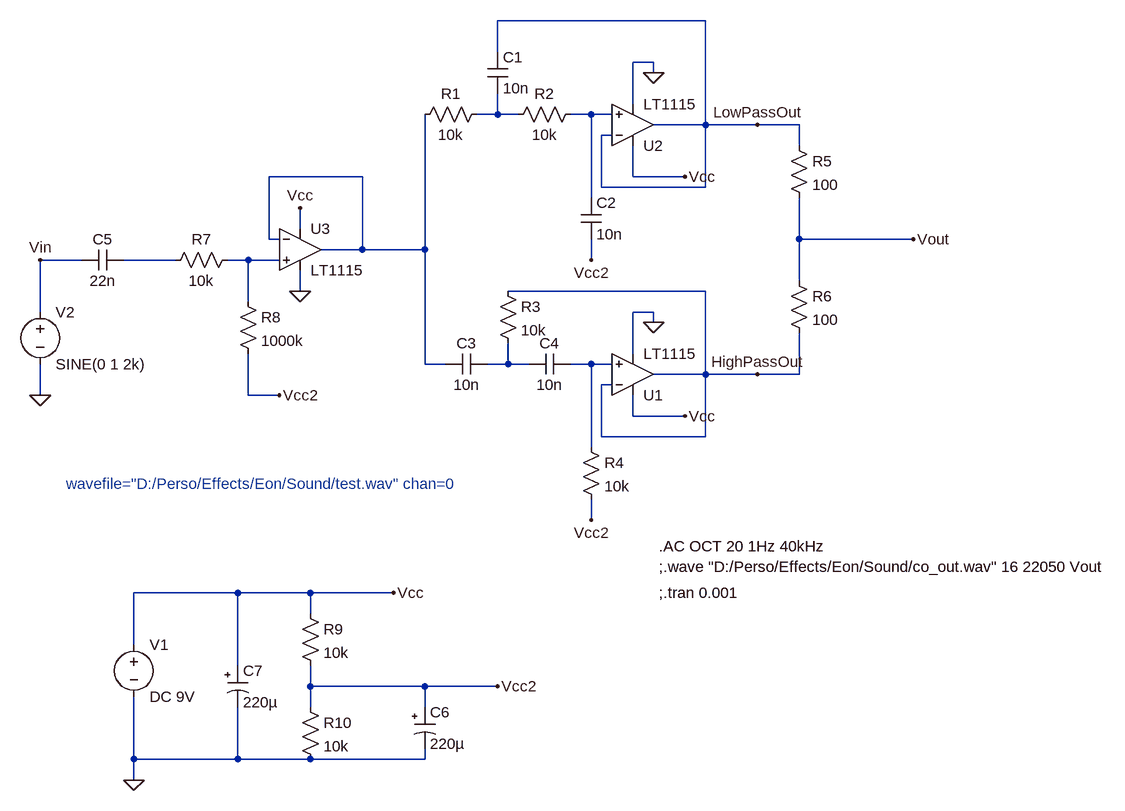
[diagram p0: schematic crossover_add.asc]
crossover_add.asc, the LTspice schematic file:
Version 4
SHEET 1 1140 1104
WIRE -32 -80 -352 -80
WIRE -352 -32 -352 -80
WIRE -112 -16 -144 -16
WIRE -112 0 -112 -16
WIRE -144 48 -144 -16
WIRE -352 64 -352 32
WIRE -352 64 -384 64
WIRE -320 64 -352 64
WIRE -208 64 -240 64
WIRE -176 64 -208 64
WIRE -32 80 -32 -80
WIRE -32 80 -112 80
WIRE 48 80 -32 80
WIRE 112 80 48 80
WIRE -176 96 -192 96
WIRE 112 112 112 80
WIRE -560 160 -704 160
WIRE -144 160 -144 112
WIRE -64 160 -144 160
WIRE -192 176 -192 96
WIRE -32 176 -32 80
WIRE -32 176 -192 176
WIRE -208 192 -208 64
WIRE -656 240 -656 208
WIRE -704 256 -704 160
WIRE -688 256 -704 256
WIRE 112 256 112 192
WIRE 288 256 112 256
WIRE -560 272 -560 160
WIRE -560 272 -624 272
WIRE -464 272 -464 64
WIRE -464 272 -560 272
WIRE -992 288 -1056 288
WIRE -848 288 -928 288
WIRE -736 288 -768 288
WIRE -688 288 -736 288
WIRE -208 288 -208 256
WIRE 112 320 112 256
WIRE -656 336 -656 304
WIRE -32 336 -336 336
WIRE -736 352 -736 288
WIRE -1056 368 -1056 288
WIRE -112 368 -144 368
WIRE -112 384 -112 368
WIRE -144 432 -144 368
WIRE -464 448 -464 272
WIRE -432 448 -464 448
WIRE -336 448 -336 416
WIRE -336 448 -368 448
WIRE -304 448 -336 448
WIRE -208 448 -240 448
WIRE -176 448 -208 448
WIRE -32 464 -32 336
WIRE -32 464 -112 464
WIRE 48 464 -32 464
WIRE 112 464 112 400
WIRE 112 464 48 464
WIRE -176 480 -192 480
WIRE -1056 496 -1056 448
WIRE -736 496 -736 432
WIRE -688 496 -736 496
WIRE -144 528 -144 496
WIRE -64 528 -144 528
WIRE -192 560 -192 480
WIRE -32 560 -32 464
WIRE -32 560 -192 560
WIRE -208 576 -208 448
WIRE -208 688 -208 656
WIRE -752 800 -912 800
WIRE -640 800 -752 800
WIRE -512 800 -640 800
WIRE -640 832 -640 800
WIRE -912 880 -912 800
WIRE -752 912 -752 800
WIRE -640 944 -640 912
WIRE -464 944 -640 944
WIRE -352 944 -464 944
WIRE -640 976 -640 944
WIRE -464 976 -464 944
WIRE -912 1056 -912 960
WIRE -752 1056 -752 976
WIRE -752 1056 -912 1056
WIRE -640 1056 -752 1056
WIRE -464 1056 -464 1040
WIRE -464 1056 -640 1056
WIRE -912 1088 -912 1056
FLAG -208 288 Vcc2
FLAG -208 688 Vcc2
FLAG -112 0 0
FLAG -112 384 0
FLAG -64 528 Vcc
FLAG -64 160 Vcc
FLAG -688 496 Vcc2
FLAG -1056 288 Vin
FLAG -656 208 Vcc
FLAG -656 336 0
FLAG -912 1088 0
FLAG -512 800 Vcc
FLAG -352 944 Vcc2
FLAG -1056 496 0
FLAG 48 80 LowPassOut
FLAG 48 464 HighPassOut
FLAG 288 256 Vout
SYMBOL LT1115 -144 528 M180
SYMATTR InstName U1
SYMBOL LT1115 -144 144 M180
SYMATTR InstName U2
SYMBOL res -368 48 R90
WINDOW 0 0 56 VBottom 2
WINDOW 3 32 56 VTop 2
SYMATTR InstName R1
SYMATTR Value 10k
SYMBOL res -224 48 R90
WINDOW 0 0 56 VBottom 2
WINDOW 3 32 56 VTop 2
SYMATTR InstName R2
SYMATTR Value 10k
SYMBOL res -352 320 R0
SYMATTR InstName R3
SYMATTR Value 10k
SYMBOL res -224 560 R0
SYMATTR InstName R4
SYMATTR Value 10k
SYMBOL cap -368 -32 R0
SYMATTR InstName C1
SYMATTR Value 10n
SYMBOL cap -224 192 R0
SYMATTR InstName C2
SYMATTR Value 10n
SYMBOL cap -368 432 R90
WINDOW 0 0 32 VBottom 2
WINDOW 3 32 32 VTop 2
SYMATTR InstName C3
SYMATTR Value 10n
SYMBOL cap -240 432 R90
WINDOW 0 0 32 VBottom 2
WINDOW 3 32 32 VTop 2
SYMATTR InstName C4
SYMATTR Value 10n
SYMBOL LT1115 -656 208 R0
SYMATTR InstName U3
SYMBOL res -752 272 R90
WINDOW 0 0 56 VBottom 2
WINDOW 3 32 56 VTop 2
SYMATTR InstName R7
SYMATTR Value 10k
SYMBOL res -752 336 R0
SYMATTR InstName R8
SYMATTR Value 1000k
SYMBOL cap -928 272 R90
WINDOW 0 0 32 VBottom 2
WINDOW 3 32 32 VTop 2
SYMATTR InstName C5
SYMATTR Value 22n
SYMBOL voltage -912 864 R0
SYMATTR InstName V1
SYMATTR Value DC 9V
SYMBOL res -656 816 R0
SYMATTR InstName R9
SYMATTR Value 10k
SYMBOL res -656 960 R0
SYMATTR InstName R10
SYMATTR Value 10k
SYMBOL polcap -480 976 R0
SYMATTR InstName C6
SYMATTR Value 220µ
SYMBOL polcap -768 912 R0
SYMATTR InstName C7
SYMATTR Value 220µ
SYMBOL voltage -1056 352 R0
SYMATTR InstName V2
SYMATTR Value SINE(0 1 2k)
SYMATTR Value2 AC 1V 0
SYMBOL res 96 96 R0
SYMATTR InstName R5
SYMATTR Value 100
SYMBOL res 96 304 R0
SYMATTR InstName R6
SYMATTR Value 100
TEXT -104 760 Left 2 !;.wave "D:/Perso/Effects/Eon/Sound/co_out.wav" 16 22050 Vout
TEXT -104 800 Left 2 !;.tran 0.001
TEXT -1016 632 Left 2 ;wavefile="D:/Perso/Effects/Eon/Sound/test.wav" chan=0
TEXT -104 728 Left 2 !.AC OCT 20 1Hz 40kHz

The netlist it stands for:
* crossover_add.asc
XU1 N007 HighPassOut Vcc 0 HighPassOut LT1028  ; LT1115, pins In+ In- V+ V- OUT
XU2 N002 LowPassOut Vcc 0 LowPassOut LT1028  ; LT1115, pins In+ In- V+ V- OUT
R1 N001 N003 10k
R2 N002 N001 10k
R3 HighPassOut N006 10k
R4 N007 Vcc2 10k
C1 LowPassOut N001 10n
C2 N002 Vcc2 10n
C3 N006 N003 10n
C4 N007 N006 10n
XU3 N005 N003 Vcc 0 N003 LT1028  ; LT1115, pins In+ In- V+ V- OUT
R7 N005 N004 10k
R8 N005 Vcc2 1000k
C5 N004 Vin 22n
V1 Vcc 0 DC 9V
R9 Vcc Vcc2 10k
R10 Vcc2 0 10k
C6 Vcc2 0 220µ
C7 Vcc 0 220µ
V2 Vin 0 SINE(0 1 2k) AC 1V 0
R5 LowPassOut Vout 100
R6 Vout HighPassOut 100
;.wave "D:/Perso/Effects/Eon/Sound/co_out.wav" 16 22050 Vout
;.tran 0.001
* wavefile="D:/Perso/Effects/Eon/Sound/test.wav" chan=0
.AC OCT 20 1Hz 40kHz
.lib LTC.lib
.backanno
.end